# EAGLE schematic schematicv2 (EAGLE 7.6.0)
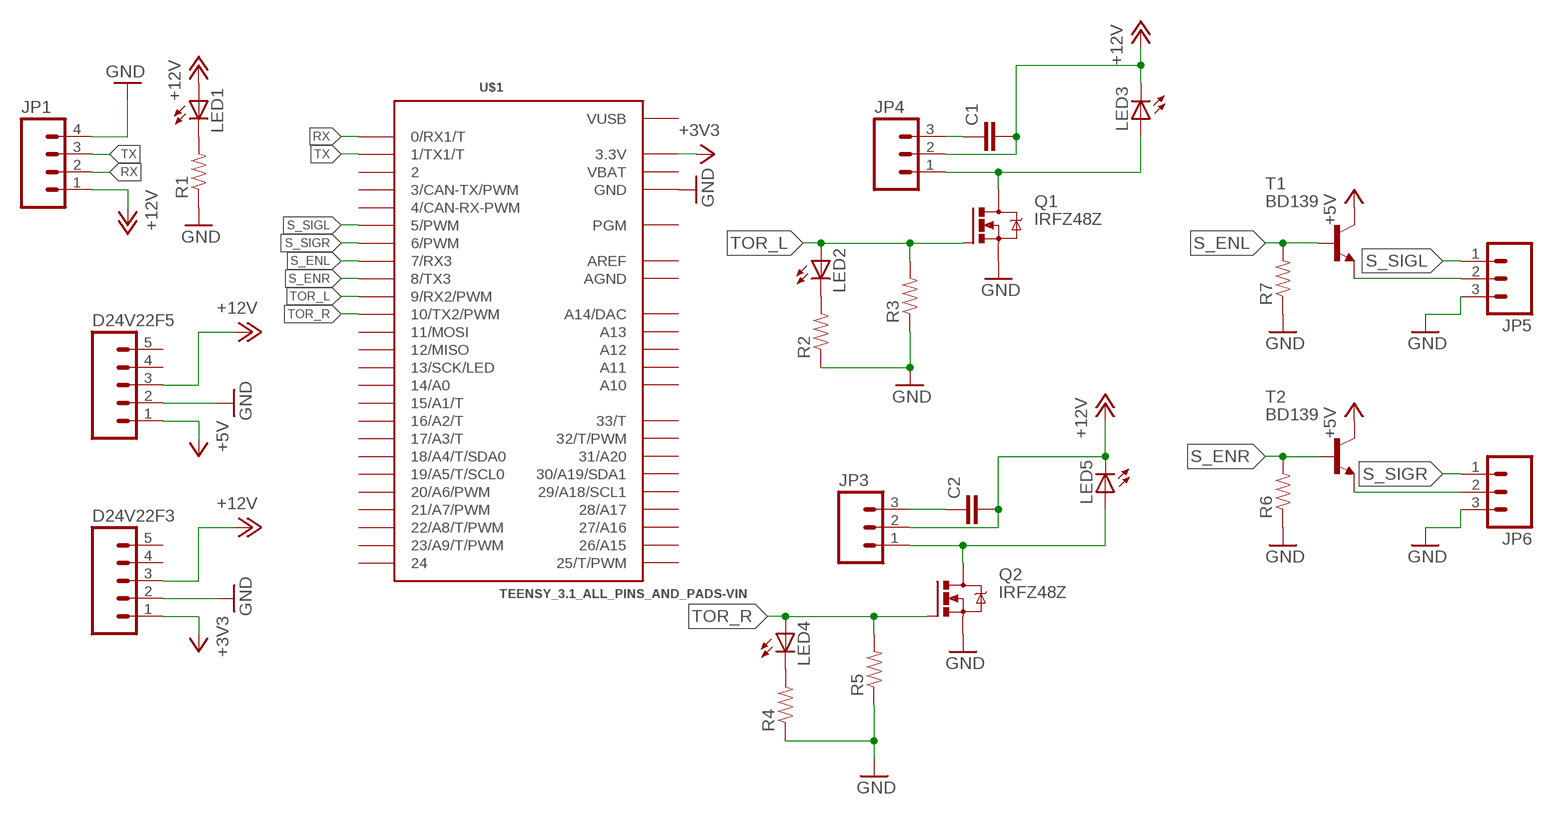
[diagram p0: schematic, sheet 1]

## Parts
C1  CAP0805  [0805]
C2  CAP0805  [0805]
D24V22F3  M05PTH  [1X05]
D24V22F5  M05PTH  [1X05]
JP1  M04POLAR  [MOLEX-1X4]
JP3  M03POLAR  [MOLEX-1X3]
JP4  M03POLAR  [MOLEX-1X3]
JP5  M03POLAR  [MOLEX-1X3]
JP6  M03POLAR  [MOLEX-1X3]
LED1  LEDCHIP-LED0603  [CHIP-LED0603]
LED2  LEDCHIP-LED0603  [CHIP-LED0603]
LED3  LEDCHIP-LED0603  [CHIP-LED0603]
LED4  LEDCHIP-LED0603  [CHIP-LED0603]
LED5  LEDCHIP-LED0603  [CHIP-LED0603]
Q1  IRFZ48Z  [TO220BH]
Q2  IRFZ48Z  [TO220BH]
R1  RESISTOR0805-RES  [0805]
R2  RESISTOR0805-RES  [0805]
R3  RESISTOR0805-RES  [0805]
R4  RESISTOR0805-RES  [0805]
R5  RESISTOR0805-RES  [0805]
R6  RESISTOR0805-RES  [0805]
R7  RESISTOR0805-RES  [0805]
T1  BD139  [TO126]
T2  BD139  [TO126]
U$1  TEENSY_3.1_ALL_PINS_AND_PADS-VIN  [TEENSY_3.1_ALLPINS-VIN]

## Nets
+3V3: D24V22F3.1 U$1.3.3V U$1.3.3V1(3.3V) U$1.3.3V2(3.3V)
+5V: D24V22F5.1 T1.2(C) T2.2(C)
+12V: C1.2 C2.2 D24V22F3.3 D24V22F5.3 JP1.1 JP3.2 JP4.2 LED1.A LED3.C LED5.C
GND: D24V22F3.2 D24V22F5.2 JP1.4 JP5.3 JP6.3 Q1.S Q2.S R1.1 R2.1 R3.1 R4.1 R5.1 R6.1 R7.1 U$1.GND U$1.GND1(GND) U$1.GND2(GND)
N$1: LED1.C R1.2
N$2: LED2.C R2.2
N$3: LED4.C R4.2
N$4: C1.1 JP4.3
N$5: JP4.1 LED3.A Q1.D
N$6: JP6.2 T2.1(E)
N$7: C2.1 JP3.3
N$8: JP5.2 T1.1(E)
N$10: JP3.1 LED5.A Q2.D
RX: JP1.2 U$1.0(0/RX1/T)
S_ENL: R7.2 T1.3(B) U$1.7(7/RX3)
S_ENR: R6.2 T2.3(B) U$1.8(8/TX3)
S_SIGL: JP5.1 U$1.5(5/PWM)
S_SIGR: JP6.1 U$1.6(6/PWM)
TOR_L: LED2.A Q1.G R3.2 U$1.9(9/RX2/PWM)
TOR_R: LED4.A Q2.G R5.2 U$1.10(10/TX2/PWM)
TX: JP1.3 U$1.1(1/TX1/T)
Unconnected: D24V22F3.4 D24V22F3.5 D24V22F5.4 D24V22F5.5 U$1.2 U$1.3(3/CAN-TX/PWM) U$1.4(4/CAN-RX-PWM) U$1.11(11/MOSI) U$1.12(12/MISO) U$1.13(13/SCK/LED) U$1.14/A0 U$1.15/A1(15/A1/T) U$1.16/A2(16/A2/T) U$1.17/A3(17/A3/T) U$1.18/A4(18/A4/T/SDA0) U$1.19/A5(19/A5/T/SCL0) U$1.20/A6(20/A6/PWM) U$1.21/A7(21/A7/PWM) U$1.22/A8(22/A8/T/PWM) U$1.23/A9(23/A9/T/PWM) U$1.24 U$1.25(25/T/PWM) U$1.26(26/A15) U$1.27(27/A16) U$1.28(28/A17) U$1.29(29/A18/SCL1) U$1.30(30/A19/SDA1) U$1.31(31/A20) U$1.32(32/T/PWM) U$1.33(33/T) U$1.A10 U$1.A11 U$1.A12 U$1.A13 U$1.A14(A14/DAC) U$1.PGM

## Power pins joined to a net without a drawn wire
AGND: U$1.AGND
AREF: U$1.AREF
VBAT: U$1.VBAT
VUSB: U$1.VUSB

## Library data of the parts
C1 C2 = SparkFun:CAP: Capacitor Standard 0603 ceramic capacitor, and 0.1" leaded capacitor.
D24V22F3 D24V22F5 = SparkFun:M05: Header 5 Standard 5-pin 0.1" header. Use with straight break away headers (SKU : PRT-00116), right angle break away headers (PRT-00553), swiss pins (PRT-00743), machine pins (PRT-00117), and female headers (PRT-00115). Molex polarized connector foot print use with SKU : PRT-08230 with associated crimp pins and housings.
JP1 = SparkFun:M04: Header 4 Standard 4-pin 0.1" header. Use with straight break away headers (SKU : PRT-00116), right angle break away headers (PRT-00553), swiss pins (PRT-00743), machine pins (PRT-00117), and female headers (PRT-00115). Molex polarized connector foot print use with SKU : PRT-08231 with associated crimp pins and housings. 1MM SMD Version SKU: PRT-10208
JP3-JP6 = SparkFun:M03: Header 3 Standard 3-pin 0.1" header. Use with straight break away headers (SKU : PRT-00116), right angle break away headers (PRT-00553), swiss pins (PRT-00743), machine pins (PRT-00117), and female headers (PRT-00115). Molex polarized connector foot print use with SKU : PRT-08232 with associated crimp pins and housings.
LED1-LED5 = adafruit:LED: LED OSRAM: - CHIPLED LG R971, LG N971, LY N971, LG Q971, LY Q971, LO R971, LY R971 LH N974, LH R974 LS Q976, LO Q976, LY Q976 LO Q996 - Hyper CHIPLED LW Q18S LB Q993, LB Q99A, LB R99A - SideLED LS A670, LO A670, LY A670, LG A670, LP A670 LB A673, LV A673, LT A673, LW A673 LH A674 LY A675 LS A676, LA A676, LO A676, LY A676, LW A676 LS A679, LY A679, LG A679 - Hyper Micro SIDELED® LS Y876, LA Y876, LO Y876, LY Y876 LT Y87S - SmartLED LW L88C, LW L88S LB L89C, LB L89S, LG L890 LS L89K, LO L89K, LY L89K LS L896, LA L896, LO L896, LY L896 - TOPLED LS T670, LO T670, LY T670, LG T670, LP T670 LSG T670, LSP T670, LSY T670, LOP T670, LYG T670 LG T671, LOG T671, LSG T671 LB T673, LV T673, LT T673, LW T673 LH T674 LS T676, LA T676, LO T676, LY T676, LB T676, LH T676, LSB T676, LW T676 LB T67C, LV T67C, LT T67C, LS T67K, LO T67K, LY T67K, LW E67C LS E67B, LA E67B, LO E67B, LY E67B, LB E67C, LV E67C, LT E67C LW T67C LS T679, LY T679, LG T679 LS T770, LO T770, LY T770, LG T770, LP T770 LB T773, LV T773, LT T773, LW T773 LH T774 LS E675, LA E675, LY E675, LS T675 LS T776, LA T776, LO T776, LY T776, LB T776 LHGB T686 LT T68C, LB T68C - Hyper Mini TOPLED® LB M676 - Mini TOPLED Santana® LG M470 LS M47K, LO M47K, LY M47K Source: http://www.osram.convergy.de/
Q1 Q2 = transistor-power:IRFZ48: N Channel HEXFET® Power MOSFET Logic Level Source: http://www.irf.com/product-info/datasheets/data/irfz48z.pdf
R1-R7 = SparkFun:RESISTOR: Resistor Basic schematic elements and footprints for 0603, 1206, and PTH resistors.
T1 T2 = transistor:BD139: NPN TRANSISTOR
U$1 = Teensy_3_Series_Board_v1.0:TEENSY_3.1_ALL_PINS_AND_PADS-VIN: Footprint for Teensy 3.1 board using all pads and all through-holes, with the exception of the VIN pin. Use this option if you want to use an external voltage regulator for the Teensy. Pads need a 2x7 0.1" SMD header.